# Altium schematic sheet CAN.SchDoc
size A4; SheetNumber: 13; SheetTotal: 13
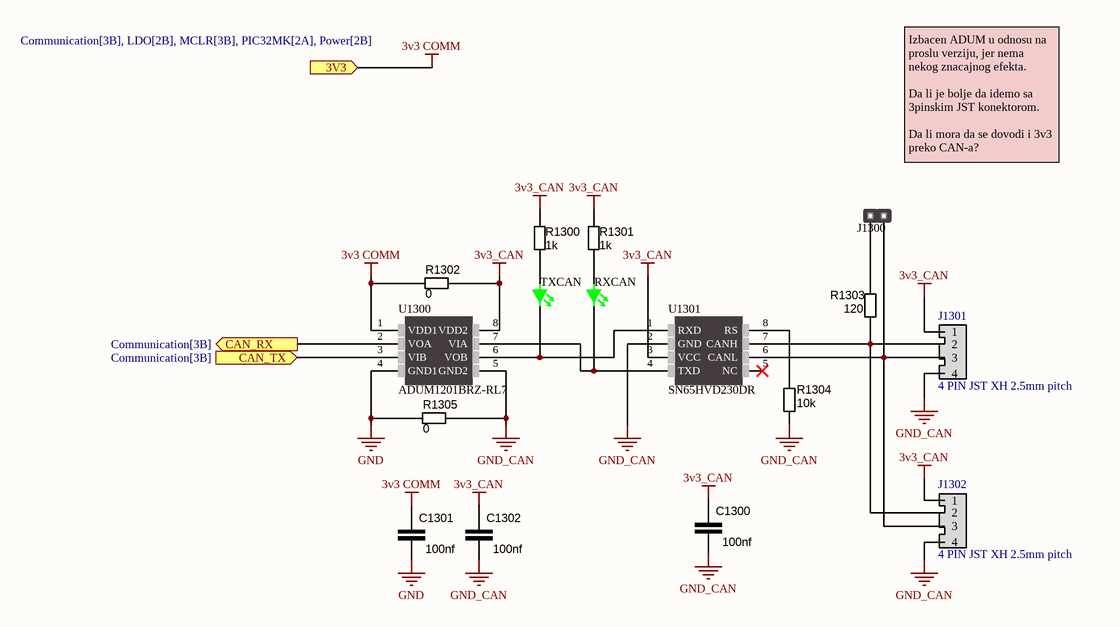
[diagram p0: CAN.SchDoc]

## Parts
C1300  100nf  [CAP_0603]
C1301  100nf  [CAP_0603]
C1302  100nf  [CAP_0603]
J1300  *  [HM1x2]  (value not drawn)
J1301  4 PIN JST XH 2.5mm pitch  [JST4PIN]
J1302  4 PIN JST XH 2.5mm pitch  [JST4PIN]
R1300  1k  [RES_0603]
R1301  1k  [RES_0603]
R1302  0  [RES_0603]
R1303  120  [RES_0603]
R1304  10k  [RES_0603]
R1305  0  [RES_0603]
RXCAN  GREEN LED  [DIOC1608X04N]  (value not drawn)
TXCAN  GREEN LED  [DIOC1608X04N]  (value not drawn)
U1300  ADUM1201BRZ-RL7  [SOIC-8]
U1301  SN65HVD230DR  [SOIC-8]

## Ports
3V3 (in, see Communication[3B], LDO[2B], MCLR[3B], PIC32MK[2A], Power[2B]), CAN_RX (out, see Communication[3B]), CAN_TX (in, see Communication[3B])

## Nets
3v3 COMM: C1301.2 R1302.1 U1300.1(VDD1) ; port 3V3
3v3_CAN: C1300.2 C1302.2 J1301.1 J1302.1 R1300.2 R1301.2 R1302.2 U1300.8(VDD2) U1301.3(VCC)
GND: C1301.1 R1305.2 U1300.4(GND1)
GND_CAN: C1300.1 C1302.1 J1301.4 J1302.4 R1304.1 R1305.1 U1300.5(GND2) U1301.2(GND)
CAN_RX: U1300.2(VOA) ; port CAN_RX
CAN_TX: U1300.3(VIB) ; port CAN_TX
NetJ1300_1: J1300.1 R1303.2
NetJ1300_2: J1300.2 J1301.3 J1302.3 U1301.6(CANL)
NetJ1301_2: J1301.2 J1302.2 R1303.1 U1301.7(CANH)
NetR1300_1: R1300.1 TXCAN.1
NetR1301_1: R1301.1 RXCAN.1
NetR1304_2: R1304.2 U1301.8(RS)
NetRXCAN_2: RXCAN.2 U1300.7(VIA) U1301.4(TXD)
NetTXCAN_2: TXCAN.2 U1300.6(VOB) U1301.1(RXD)

Not connected (* = marked no-connect by the designer): U1301 5(NC)*

## Notes on the sheet
- Izbacen ADUM u odnosu na proslu verziju, jer nema nekog znacajnog efekta.
  Da li je bolje da idemo sa 3pinskim JST konektorom.
  Da li mora da se dovodi i 3v3 preko CAN-a?

## Library data of the parts
C1300-C1302 = C000007: CAP CER 100nF 0603 25V X7R; capaticanse: 100nf; ComponentLink1Description: digikey; ComponentLink1URL: https://www.digikey.com/en/products/detail/kyocera-avx/06033C104K4T2A/8019250
J1300 = HEADER_1x2: Manufacturer Part Number: *
J1301 J1302 = JST4PIN
R1300 R1301 = R000004: RES 1k OHM 1% 1/10W 0603; resistance: 1Kohm; ComponentLink1Description: digikey; ComponentLink1URL: https://www.digikey.com/en/products/detail/vishay-beyschlag-draloric-bc-components/MCT06030C1001FP500/2607821
R1302 = R000004: RES 0 OHM 1% 1/10W 0603; resistance: 1Kohm; ComponentLink1Description: digikey; ComponentLink1URL: https://www.digikey.com/en/products/detail/vishay-beyschlag-draloric-bc-components/MCT06030C1001FP500/2607821
R1303 = R000004: RES 120 OHM 1% 1/10W 0603; resistance: 1Kohm; ComponentLink1Description: digikey; ComponentLink1URL: https://www.digikey.com/en/products/detail/vishay-beyschlag-draloric-bc-components/MCT06030C1001FP500/2607821
R1304 R1305 = R000004: RES 10k OHM 1% 1/10W 0603; resistance: 1Kohm; ComponentLink1Description: digikey; ComponentLink1URL: https://www.digikey.com/en/products/detail/vishay-beyschlag-draloric-bc-components/MCT06030C1001FP500/2607821
RXCAN TXCAN = 00000001: LED GREEN DIFFUSED 0603 SMD; Supplier 1: Avnet; Supplier Part Number 1: Q65111A3964; ComponentLink1Description: Digikey; ComponentLink1URL: https://www.digikey.com/en/products/detail/ams-osram-usa-inc/LG-Q396-PS-35/5249855
U1300 = ADUM1201BRZ: DGTL ISO 2.5KV GEN PURP 8SOIC; Assembly: SMD; Barcode: 00000001; Manufacturer Part Number: ADUM1201BRZ-RL7; Datasheet Link: http://www.analog.com/media/en/technical-documentation/data-sheets/ADuM1200_1201.pdf; Category: Integrated Circuits (ICs); Package: SOIC-8; Family: Comunication
U1301 = SN65HVD230: IC EMC CAN TRANSCEIVER 8-SOIC; Assembly: SMD; Barcode: 00000001; Manufacturer Part Number: SN65HVD230DR; Comet Product Page: http://store.comet.rs/Catalogue/Product/9057/; Datasheet Link: http://www.ti.com/lit/ds/symlink/sn65hvd232.pdf; Category: Integrated Circuits (ICs); Package: SOIC-8; Family: Comunication